# Altium schematic sheet keyboard.SchDoc
size A4
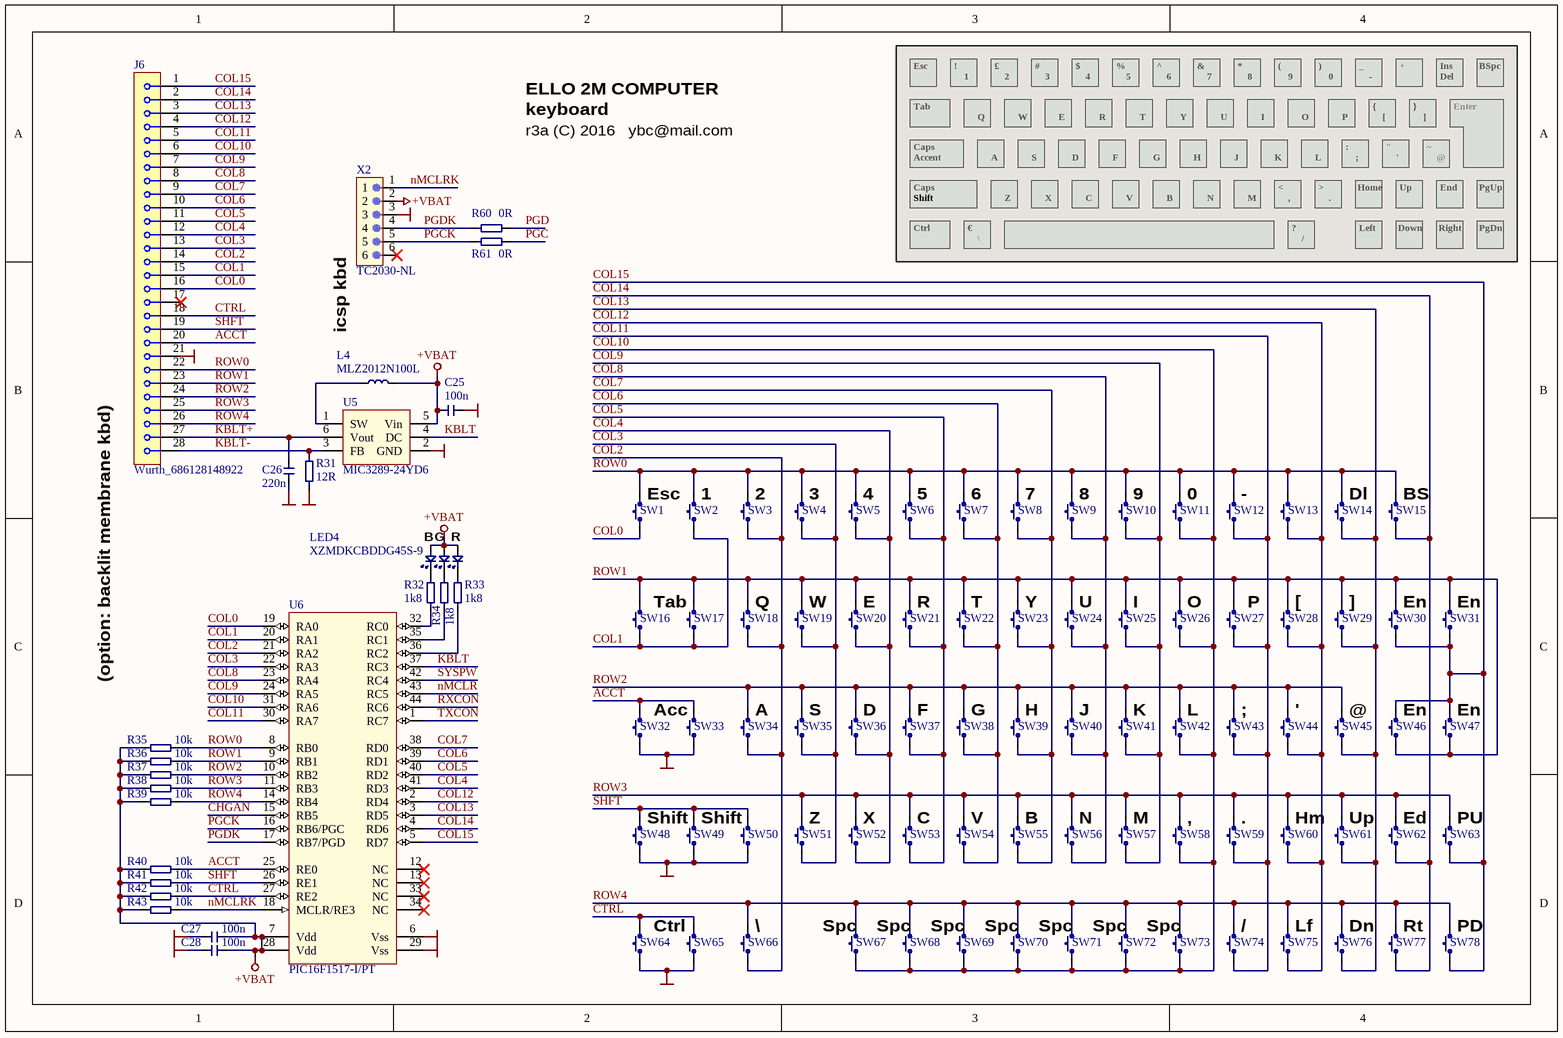
[diagram p0: keyboard.SchDoc]

## Parts
C25  100n  [_0603]
C26  220n  [_0603]
C27  100n  [_0603]
C28  100n  [_0603]
J6  Wurth_686128148922  [Wurth_686128148922]
L4  MLZ2012N100L  [_0805_IND]
LED4  XZMDKCBDDG45S-9  [LED RGB XZMDKCBDDG45S-9]
R31  12R  [_1206]
R32  1k8  [_0603]
R33  1k8  [_0603]
R34  1k8  [_0603]
R35  10k  [_0603]
R36  10k  [_0603]
R37  10k  [_0603]
R38  10k  [_0603]
R39  10k  [_0603]
R40  10k  [_0603]
R41  10k  [_0603]
R42  10k  [_0603]
R43  10k  [_0603]
R60  0R  [_0603]
R61  0R  [_0603]
SW1  (no value)  [Rubber Switch Pad (12mm)]  (no BOM)
SW2  (no value)  [Rubber Switch Pad (12mm)]  (no BOM)
SW3  (no value)  [Rubber Switch Pad (12mm)]  (no BOM)
SW4  (no value)  [Rubber Switch Pad (12mm)]  (no BOM)
SW5  (no value)  [Rubber Switch Pad (12mm)]  (no BOM)
SW6  (no value)  [Rubber Switch Pad (12mm)]  (no BOM)
SW7  (no value)  [Rubber Switch Pad (12mm)]  (no BOM)
SW8  (no value)  [Rubber Switch Pad (12mm)]  (no BOM)
SW9  (no value)  [Rubber Switch Pad (12mm)]  (no BOM)
SW10  (no value)  [Rubber Switch Pad (12mm)]  (no BOM)
SW11  (no value)  [Rubber Switch Pad (12mm)]  (no BOM)
SW12  (no value)  [Rubber Switch Pad (12mm)]  (no BOM)
SW13  (no value)  [Rubber Switch Pad (12mm)]  (no BOM)
SW14  (no value)  [Rubber Switch Pad (12mm)]  (no BOM)
SW15  (no value)  [Rubber Switch Pad (12mm)]  (no BOM)
SW16  (no value)  [Rubber Switch Pad (8x12mm)]  (no BOM)
SW17  (no value)  [Rubber Switch Pad (8x12mm)]  (no BOM)
SW18  (no value)  [Rubber Switch Pad (12mm)]  (no BOM)
SW19  (no value)  [Rubber Switch Pad (12mm)]  (no BOM)
SW20  (no value)  [Rubber Switch Pad (12mm)]  (no BOM)
SW21  (no value)  [Rubber Switch Pad (12mm)]  (no BOM)
SW22  (no value)  [Rubber Switch Pad (12mm)]  (no BOM)
SW23  (no value)  [Rubber Switch Pad (12mm)]  (no BOM)
SW24  (no value)  [Rubber Switch Pad (12mm)]  (no BOM)
SW25  (no value)  [Rubber Switch Pad (12mm)]  (no BOM)
SW26  (no value)  [Rubber Switch Pad (12mm)]  (no BOM)
SW27  (no value)  [Rubber Switch Pad (12mm)]  (no BOM)
SW28  (no value)  [Rubber Switch Pad (12mm)]  (no BOM)
SW29  (no value)  [Rubber Switch Pad (12mm)]  (no BOM)
SW30  (no value)  [Rubber Switch Pad (10x16mm)]  (no BOM)
SW31  (no value)  [Rubber Switch Pad (12x16mm)]  (no BOM)
SW32  (no value)  [Rubber Switch Pad (12mm)]  (no BOM)
SW33  (no value)  [Rubber Switch Pad (10x12mm)]  (no BOM)
SW34  (no value)  [Rubber Switch Pad (12mm)]  (no BOM)
SW35  (no value)  [Rubber Switch Pad (12mm)]  (no BOM)
SW36  (no value)  [Rubber Switch Pad (12mm)]  (no BOM)
SW37  (no value)  [Rubber Switch Pad (12mm)]  (no BOM)
SW38  (no value)  [Rubber Switch Pad (12mm)]  (no BOM)
SW39  (no value)  [Rubber Switch Pad (12mm)]  (no BOM)
SW40  (no value)  [Rubber Switch Pad (12mm)]  (no BOM)
SW41  (no value)  [Rubber Switch Pad (12mm)]  (no BOM)
SW42  (no value)  [Rubber Switch Pad (12mm)]  (no BOM)
SW43  (no value)  [Rubber Switch Pad (12mm)]  (no BOM)
SW44  (no value)  [Rubber Switch Pad (12mm)]  (no BOM)
SW45  (no value)  [Rubber Switch Pad (12mm)]  (no BOM)
SW46  (no value)  [Rubber Switch Pad (8x16mm)]  (no BOM)
SW47  (no value)  [Rubber Switch Pad (8x16mm)]  (no BOM)
SW48  (no value)  [Rubber Switch Pad (8x12mm)]  (no BOM)
SW49  (no value)  [Rubber Switch Pad (10X12mm)]  (no BOM)
SW50  (no value)  [Rubber Switch Pad (8x12mm)]  (no BOM)
SW51  (no value)  [Rubber Switch Pad (12mm)]  (no BOM)
SW52  (no value)  [Rubber Switch Pad (12mm)]  (no BOM)
SW53  (no value)  [Rubber Switch Pad (12mm)]  (no BOM)
SW54  (no value)  [Rubber Switch Pad (12mm)]  (no BOM)
SW55  (no value)  [Rubber Switch Pad (12mm)]  (no BOM)
SW56  (no value)  [Rubber Switch Pad (12mm)]  (no BOM)
SW57  (no value)  [Rubber Switch Pad (12mm)]  (no BOM)
SW58  (no value)  [Rubber Switch Pad (12mm)]  (no BOM)
SW59  (no value)  [Rubber Switch Pad (12mm)]  (no BOM)
SW60  (no value)  [Rubber Switch Pad (12mm)]  (no BOM)
SW61  (no value)  [Rubber Switch Pad (12mm)]  (no BOM)
SW62  (no value)  [Rubber Switch Pad (12mm)]  (no BOM)
SW63  (no value)  [Rubber Switch Pad (12mm)]  (no BOM)
SW64  (no value)  [Rubber Switch Pad (8x12mm)]  (no BOM)
SW65  (no value)  [Rubber Switch Pad (8x12mm)]  (no BOM)
SW66  (no value)  [Rubber Switch Pad (12mm)]  (no BOM)
SW67  (no value)  [Rubber Switch Pad (14x12mm)]  (no BOM)
SW68  (no value)  [Rubber Switch Pad (16x12mm)]  (no BOM)
SW69  (no value)  [Rubber Switch Pad (16x12mm)]  (no BOM)
SW70  (no value)  [Rubber Switch Pad (16x12mm)]  (no BOM)
SW71  (no value)  [Rubber Switch Pad (16x12mm)]  (no BOM)
SW72  (no value)  [Rubber Switch Pad (16x12mm)]  (no BOM)
SW73  (no value)  [Rubber Switch Pad (14x12mm)]  (no BOM)
SW74  (no value)  [Rubber Switch Pad (12mm)]  (no BOM)
SW75  (no value)  [Rubber Switch Pad (12mm)]  (no BOM)
SW76  (no value)  [Rubber Switch Pad (12mm)]  (no BOM)
SW77  (no value)  [Rubber Switch Pad (12mm)]  (no BOM)
SW78  (no value)  [Rubber Switch Pad (12mm)]  (no BOM)
U5  MIC3289-24YD6  [SOT23-6]
U6  PIC16F1517-I/PT  [QFP80P1200X1200X120-44N]
X2  TC2030-NL  [TC2030-NL]  (no BOM)

## Nets
+VBAT: C25.1 C27.2 C28.2 L4.2 LED4.2 R35.1 R36.1 R37.1 R38.1 R39.1 R40.1 R41.1 R42.1 R43.1 U5.5(Vin) U6.7(Vdd) U6.28(Vdd) X2.2
GND: C25.2 C26.1 C27.1 C28.1 J6.21 R31.2 SW32.1 SW33.1 SW48.1 SW49.1 SW50.1 SW64.1 SW65.1 U5.2(GND) U6.6(Vss) U6.29(Vss) X2.3
ACCT: J6.20 R40.2 SW32.2 SW33.2 U6.25(RE0)
CHGAN: U6.15(RB5)
COL0: J6.16 SW1.1 U6.19(RA0)
COL1: J6.15 SW2.1 SW16.1 SW17.1 U6.20(RA1)
COL2: J6.14 SW3.1 SW18.1 SW34.1 SW66.1 U6.21(RA2)
COL3: J6.13 SW4.1 SW19.1 SW35.1 SW51.1 U6.22(RA3)
COL4: J6.12 SW5.1 SW20.1 SW36.1 SW52.1 U6.41(RD3)
COL5: J6.11 SW6.1 SW21.1 SW37.1 SW53.1 U6.40(RD2)
COL6: J6.10 SW7.1 SW22.1 SW38.1 SW54.1 U6.39(RD1)
COL7: J6.9 SW8.1 SW23.1 SW39.1 SW55.1 U6.38(RD0)
COL8: J6.8 SW9.1 SW24.1 SW40.1 SW56.1 U6.23(RA4)
COL9: J6.7 SW10.1 SW25.1 SW41.1 SW57.1 U6.24(RA5)
COL10: J6.6 SW11.1 SW26.1 SW42.1 SW58.1 SW67.1 SW68.1 SW69.1 SW70.1 SW71.1 SW72.1 SW73.1 U6.31(RA6)
COL11: J6.5 SW12.1 SW27.1 SW43.1 SW59.1 SW74.1 U6.30(RA7)
COL12: J6.4 SW13.1 SW28.1 SW44.1 SW60.1 SW75.1 U6.2(RD4)
COL13: J6.3 SW14.1 SW29.1 SW45.1 SW61.1 SW76.1 U6.3(RD5)
COL14: J6.2 SW15.1 SW62.1 SW77.1 U6.4(RD6)
COL15: J6.1 SW30.1 SW31.1 SW46.2 SW47.2 SW63.1 SW78.1 U6.5(RD7)
CTRL: J6.18 R42.2 SW64.2 SW65.2 U6.27(RE2)
KBLT: U5.4(DC) U6.37(RC3)
KBLT+: C26.2 J6.27 U5.6(Vout)
KBLT-: J6.28 R31.1 U5.3(FB)
nMCLR: U6.43(RC5)
nMCLRK: R43.2 U6.18(MCLR/RE3) X2.1
PGC: R61.1
PGCK: R61.2 U6.16(RB6/PGC) X2.5
PGD: R60.1
PGDK: R60.2 U6.17(RB7/PGD) X2.4
ROW0: J6.22 R35.2 SW1.2 SW2.2 SW3.2 SW4.2 SW5.2 SW6.2 SW7.2 SW8.2 SW9.2 SW10.2 SW11.2 SW12.2 SW13.2 SW14.2 SW15.2 U6.8(RB0)
ROW1: J6.23 R36.2 SW16.2 SW17.2 SW18.2 SW19.2 SW20.2 SW21.2 SW22.2 SW23.2 SW24.2 SW25.2 SW26.2 SW27.2 SW28.2 SW29.2 SW30.2 SW31.2 SW46.1 SW47.1 U6.9(RB1)
ROW2: J6.24 R37.2 SW34.2 SW35.2 SW36.2 SW37.2 SW38.2 SW39.2 SW40.2 SW41.2 SW42.2 SW43.2 SW44.2 SW45.2 U6.10(RB2)
ROW3: J6.25 R38.2 SW51.2 SW52.2 SW53.2 SW54.2 SW55.2 SW56.2 SW57.2 SW58.2 SW59.2 SW60.2 SW61.2 SW62.2 SW63.2 U6.11(RB3)
ROW4: J6.26 R39.2 SW66.2 SW67.2 SW68.2 SW69.2 SW70.2 SW71.2 SW72.2 SW73.2 SW74.2 SW75.2 SW76.2 SW77.2 SW78.2 U6.14(RB4)
RXCON: U6.44(RC6)
SHFT: J6.19 R41.2 SW48.2 SW49.2 SW50.2 U6.26(RE1)
SYSPW: U6.42(RC4)
TXCON: U6.1(RC7)
NetL4_1: L4.1 U5.1(SW)
NetLED4_1: LED4.1 R33.2
NetLED4_3: LED4.3 R32.2
NetLED4_4: LED4.4 R34.2
NetR32_1: R32.1 U6.32(RC0)
NetR33_1: R33.1 U6.36(RC2)
NetR34_1: R34.1 U6.35(RC1)

Not connected (* = marked no-connect by the designer): J6 17*; U6 12(NC)* 13(NC)* 33(NC)* 34(NC)*; X2 6*

## Notes on the sheet
- ELLO 2M COMPUTER
- keyboard
- Esc
- Tab
- !
- 1
- £
- 2
- #
- 3
- $
- 4
- %
- 5
- ^
- 6
- &
- 7
- *
- 8
- (
- 9
- )
- 0
- _
- -
- {
- +
- }
- Ins
- Del
- Enter
- BSpc
- r3a (C) 2016   ybc@mail.com
- Accent
- Caps
- Q
- A
- W
- S
- E
- D
- R
- F
- T
- G
- Y
- H
- U
- J
- I
- K
- O
- L
- P
- :
- ;
- [
- "
- '
- ]
- ~
- @
- (near X2) icsp kbd
- Ctrl
- Shift
- €
- \
- Z
- X
- C
- V
- B
- N
- M
- <
- ,
- ?
- /
- >
- .
- Home
- Left
- Down
- Up
- Right
- End
- PgUp
- PgDn
- (near J6) (option: backlit membrane kbd)
- (near SW1) Esc
- (near SW2) 1
- (near SW3) 2
- (near SW4) 3
- (near SW5) 4
- (near SW6) 5
- (near SW7) 6
- (near SW8) 7
- (near SW9) 8
- (near SW10) 9
- (near SW11) 0
- (near SW12) -
- (near SW14) Dl
- (near SW15) BS
- (near LED4) B
- (near LED4) G
- (near LED4) R
- (near SW18) Q
- (near SW19) W
- (near SW20) E
- (near SW21) R
- (near SW22) T
- (near SW23) Y
- (near SW24) U
- (near SW25) I
- (near SW26) O
- (near SW27) P
- (near SW28) [
- (near SW29) ]
- (near SW30) En
- (near SW31) En
- Acc
- (near SW34) A
- (near SW35) S
- (near SW36) D
- (near SW37) F
- (near SW38) G
- (near SW39) H
- (near SW40) J
- (near SW41) K
- (near SW42) L
- (near SW43) ;
- (near SW44) '
- (near SW45) @
- (near SW46) En
- (near SW47) En
- (near SW51) Z
- (near SW52) X
- (near SW53) C
- (near SW54) V
- (near SW55) B
- (near SW56) N
- (near SW57) M
- (near SW58) ,
- (near SW59) .
- (near SW60) Hm
- (near SW61) Up
- (near SW62) Ed
- (near SW63) PU
- (near SW66) \
- (near SW67) Spc
- (near SW68) Spc
- (near SW69) Spc
- (near SW70) Spc
- (near SW71) Spc
- (near SW72) Spc
- (near SW73) Spc
- (near SW74) /
- (near SW75) Lf
- (near SW76) Dn
- (near SW77) Rt
- (near SW78) PD

## Library data of the parts
C25-C28 = Capacitor
J6 = Connector 1x28: Single row, 28-way connector
L4 = Inductor
LED4 = LED Triple: RGB Light Emitting Diode
R31-R43 R60 R61 = Resistor
SW1-SW78 = Switch MNO SPST: Switch, Momentary, Normal Open
U5 = MIC3289 (SOT26): White LED Driver; Manufacturer: Microchip (Micrel)
U6 = PIC16(L)F1904/07: 44-Pin Flash Microcontrollers with nanoWatt XLP Technology; Manufacturer: Microchip; Family: PIC16(L)F1906/1907
X2 = TC2030: TC2030 nails connector; Manufacturer: www.tag-connect.com